# EAGLE design deepak_sch_FInal (EAGLE 7.5.0)
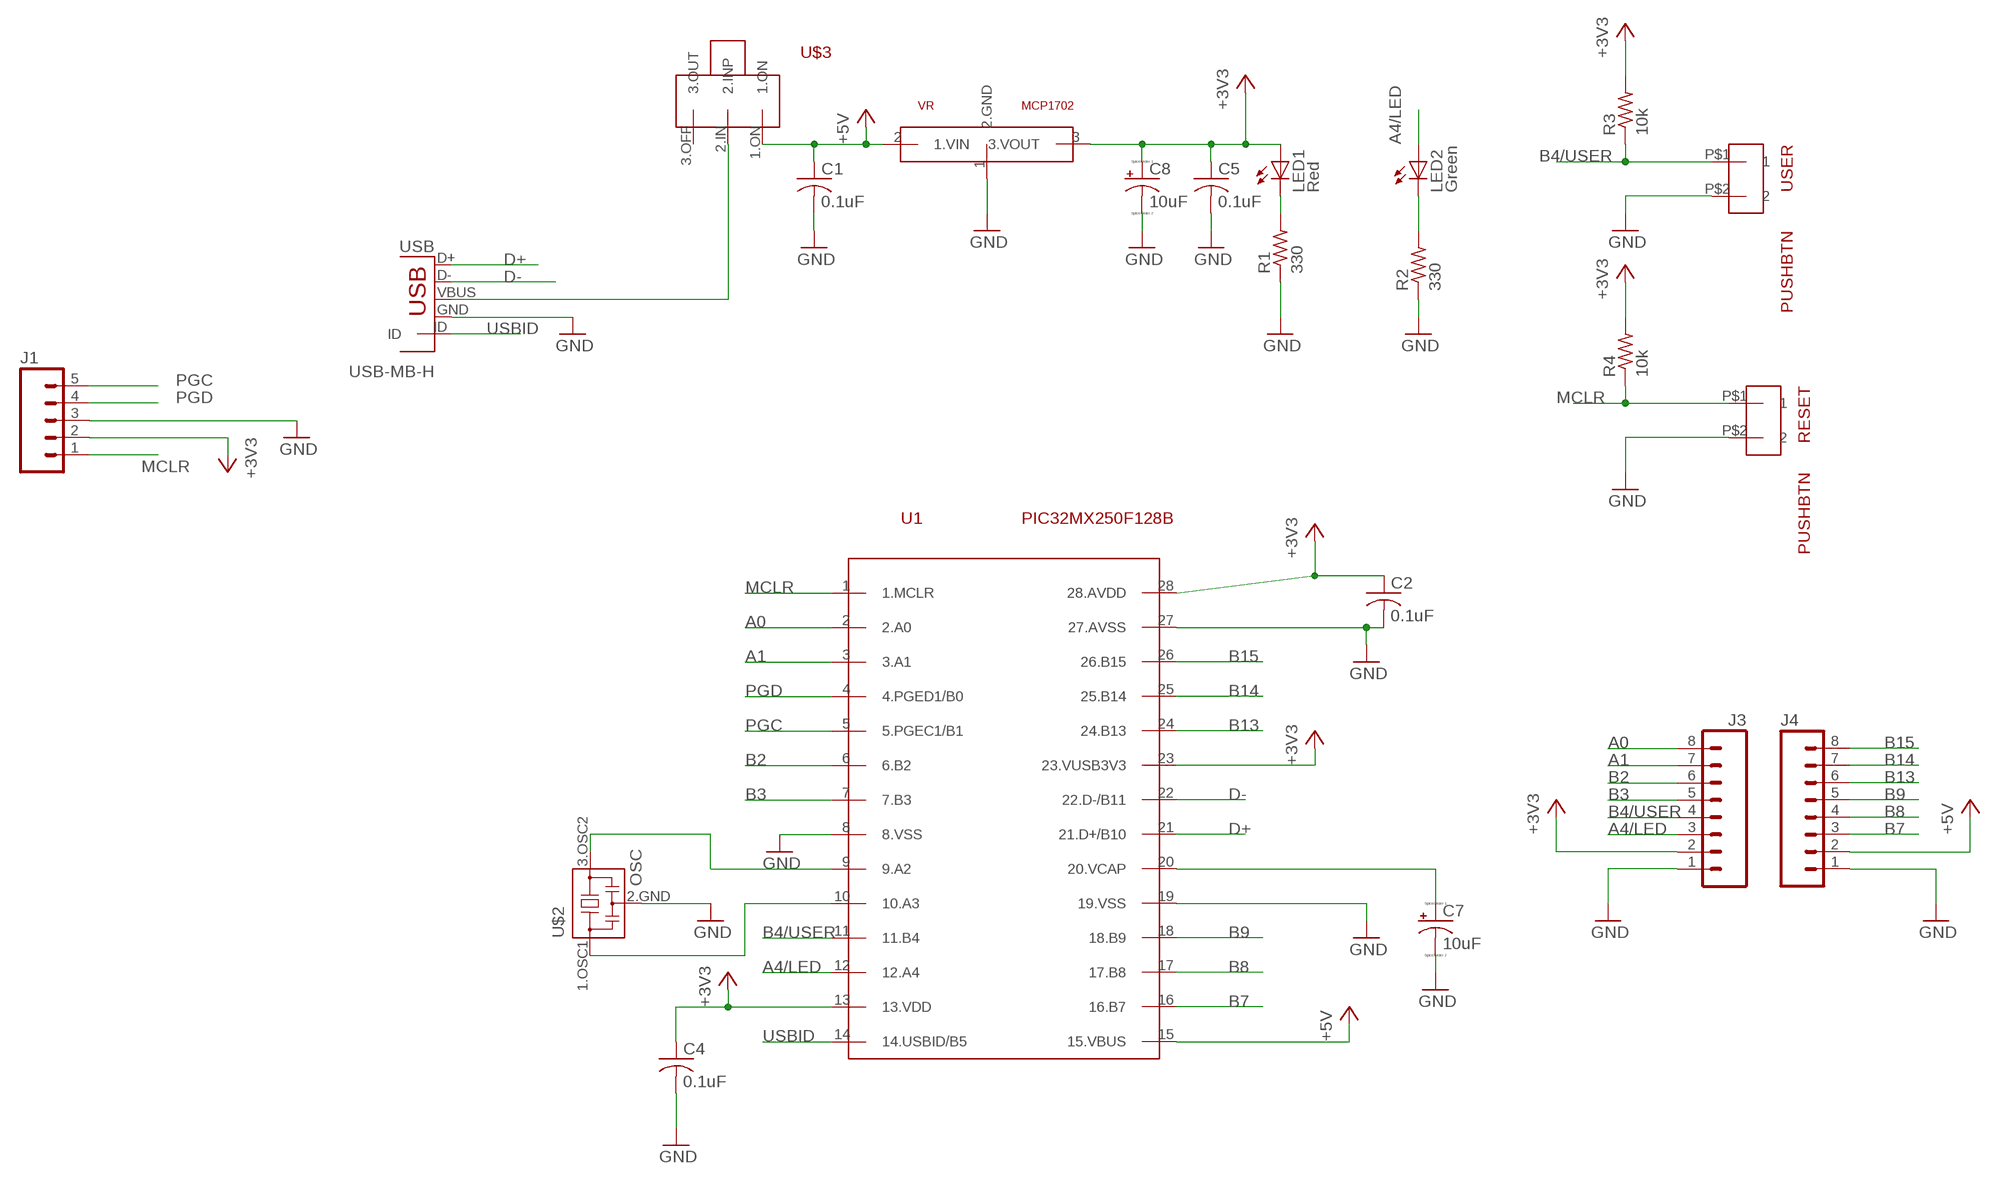
[diagram p0: schematic, sheet 1]

## Parts
C1  0.1uF  C-US025-024X044  [C025-024X044]
C2  0.1uF  C-US025-024X044  [C025-024X044]
C4  0.1uF  C-US025-024X044  [C025-024X044]
C5  0.1uF  C-US025-024X044  [C025-024X044]
C7  10uF  CPOL-USB45181A  [B45181A]
C8  10uF  CPOL-USB45181A  [B45181A]
J1  M05PTH  [1X05]
J3  M08  [1X08_ROUND]
J4  M08  [1X08_ROUND]
LED1  Red  LED3MM  [LED3MM]
LED2  Green  LED3MM  [LED3MM]
R1  330  R-US_0207/10  [0207/10]
R2  330  R-US_0207/10  [0207/10]
R3  10k  R-US_0207/10  [0207/10]
R4  10k  R-US_0207/10  [0207/10]
RESET  PUSHBTN  [PUSHBTN]
U1  PIC32MX250F128B  [DIL28-3]
U$2  OSC  [OSC]
U$3  SLIDESWITCH  [SLIDESWITCH]
USB  USB-MB-H  [USB-MB-H]
USER  PUSHBTN  [PUSHBTN]
VR  MCP1702  [TO92]

## Nets
+3V3: C2.1 C4.1 C5.1 C8.+ J1.2 J3.2 LED1.A R3.2 R4.2 U1.13(13.VDD) U1.23(23.VUSB3V3) U1.28(28.AVDD) VR.3(3.VOUT)
+5V: C1.1 J4.2 U1.15(15.VBUS) U$3.1.ON VR.2(1.VIN)
A0: J3.8 U1.2(2.A0)
A1: J3.7 U1.3(3.A1)
A4/LED: J3.3 LED2.A U1.12(12.A4)
B2: J3.6 U1.6(6.B2)
B3: J3.5 U1.7(7.B3)
B4/USER: J3.4 R3.1 U1.11(11.B4) USER.P$1
B7: J4.3 U1.16(16.B7)
B8: J4.4 U1.17(17.B8)
B9: J4.5 U1.18(18.B9)
B13: J4.6 U1.24(24.B13)
B14: J4.7 U1.25(25.B14)
B15: J4.8 U1.26(26.B15)
D+: U1.21(21.D+/B10) USB.D+
D-: U1.22(22.D-/B11) USB.D-
GND: C1.2 C2.2 C4.2 C5.2 C7.- C8.- J1.3 J3.1 J4.1 R1.1 R2.1 RESET.P$2 U1.8(8.VSS) U1.19(19.VSS) U1.27(27.AVSS) U$2.2.GND USB.GND USER.P$2 VR.1(2.GND)
MCLR: J1.1 R4.1 RESET.P$1 U1.1(1.MCLR)
N$1: U1.9(9.A2) U$2.3.OSC2
N$2: U1.10(10.A3) U$2.1.OSC1
N$3: U$3.2.IN(2.INP) USB.VBUS
N$4: LED2.K(C) R2.2
N$5: LED1.K(C) R1.2
N$11: C7.+ U1.20(20.VCAP)
PGC: J1.5 U1.5(5.PGEC1/B1)
PGD: J1.4 U1.4(4.PGED1/B0)
USBID: U1.14(14.USBID/B5) USB.ID
Unconnected: U$3.3.OFF(3.OUT)

## Library data of the parts
C1 C2 C4 C5 = ME433_2:C-US: CAPACITOR, American symbol
C7 C8 = ME433_2:CPOL-US: POLARIZED CAPACITOR, American symbol
J1 = ME433_2:M05: Header 5 Standard 5-pin 0.1" header. Use with straight break away headers (SKU : PRT-00116), right angle break away headers (PRT-00553), swiss pins (PRT-00743), machine pins (PRT-00117), and female headers (PRT-00115). Molex polarized connector foot print use with SKU : PRT-08230 with associated crimp pins and housings.
J3 J4 = ME433_2:M08: Header 8 Standard 8-pin 0.1" header. Use with straight break away headers (SKU : PRT-00116), right angle break away headers (PRT-00553), swiss pins (PRT-00743), machine pins (PRT-00117), and female headers (PRT-00115).; PROD_ID: CONN-08437
LED1 LED2 = ME433_2:LED: LED OSRAM: - CHIPLED LG R971, LG N971, LY N971, LG Q971, LY Q971, LO R971, LY R971 LH N974, LH R974 LS Q976, LO Q976, LY Q976 LO Q996 - Hyper CHIPLED LW Q18S LB Q993, LB Q99A, LB R99A - SideLED LS A670, LO A670, LY A670, LG A670, LP A670 LB A673, LV A673, LT A673, LW A673 LH A674 LY A675 LS A676, LA A676, LO A676, LY A676, LW A676 LS A679, LY A679, LG A679 - Hyper Micro SIDELED® LS Y876, LA Y876, LO Y876, LY Y876 LT Y87S - SmartLED LW L88C, LW L88S LB L89C, LB L89S, LG L890 LS L89K, LO L89K, LY L89K LS L896, LA L896, LO L896, LY L896 - TOPLED LS T670, LO T670, LY T670, LG T670, LP T670 LSG T670, LSP T670, LSY T670, LOP T670, LYG T670 LG T671, LOG T671, LSG T671 LB T673, LV T673, LT T673, LW T673 LH T674 LS T676, LA T676, LO T676, LY T676, LB T676, LH T676, LSB T676, LW T676 LB T67C, LV T67C, LT T67C, LS T67K, LO T67K, LY T67K, LW E67C LS E67B, LA E67B, LO E67B, LY E67B, LB E67C, LV E67C, LT E67C LW T67C LS T679, LY T679, LG T679 LS T770, LO T770, LY T770, LG T770, LP T770 LB T773, LV T773, LT T773, LW T773 LH T774 LS E675, LA E675, LY E675, LS T675 LS T776, LA T776, LO T776, LY T776, LB T776 LHGB T686 LT T68C, LB T68C - Hyper Mini TOPLED® LB M676 - Mini TOPLED Santana® LG M470 LS M47K, LO M47K, LY M47K Source: http://www.osram.convergy.de LUXEON: - LUMILED® LXK2-PW12-R00, LXK2-PW12-S00, LXK2-PW14-U00, LXK2-PW14-V00 LXK2-PM12-R00, LXK2-PM12-S00, LXK2-PM14-U00 LXK2-PE12-Q00, LXK2-PE12-R00, LXK2-PE12-S00, LXK2-PE14-T00, LXK2-PE14-U00 LXK2-PB12-K00, LXK2-PB12-L00, LXK2-PB12-M00, LXK2-PB14-N00, LXK2-PB14-P00, LXK2-PB14-Q00 LXK2-PR12-L00, LXK2-PR12-M00, LXK2-PR14-Q00, LXK2-PR14-R00 LXK2-PD12-Q00, LXK2-PD12-R00, LXK2-PD12-S00 LXK2-PH12-R00, LXK2-PH12-S00 LXK2-PL12-P00, LXK2-PL12-Q00, LXK2-PL12-R00 Source: www.luxeon.com KINGBRIGHT: KA-3528ASYC Source: www.kingbright.com
R1-R4 = ME433_2:R-US_: RESISTOR, American symbol
RESET USER = ME433_2:PUSHBTN
U1 = ME433_2:PIC32MX250F128B
U$2 = ME433_2:OSC
U$3 = ME433_2:SLIDESWITCH
USB = ME433_2:USB: USB Connectors USB-B-PTH is fully proven SKU : PRT-00139/CONN-08278 USB-miniB is fully proven SKU : PRT-00587 USB-A-PCB is untested. USB-A-H is throughly reviewed, but untested. Spark Fun Electronics SKU : PRT-00437 USB-B-SMT is throughly reviewed, but untested. Needs silkscreen touching up. USB-A-S has not been used/tested USB-MB-H has not been used/tested USB-MICROB has been used. CONN-09505
VR = ME433_2:MCP1702

## Board
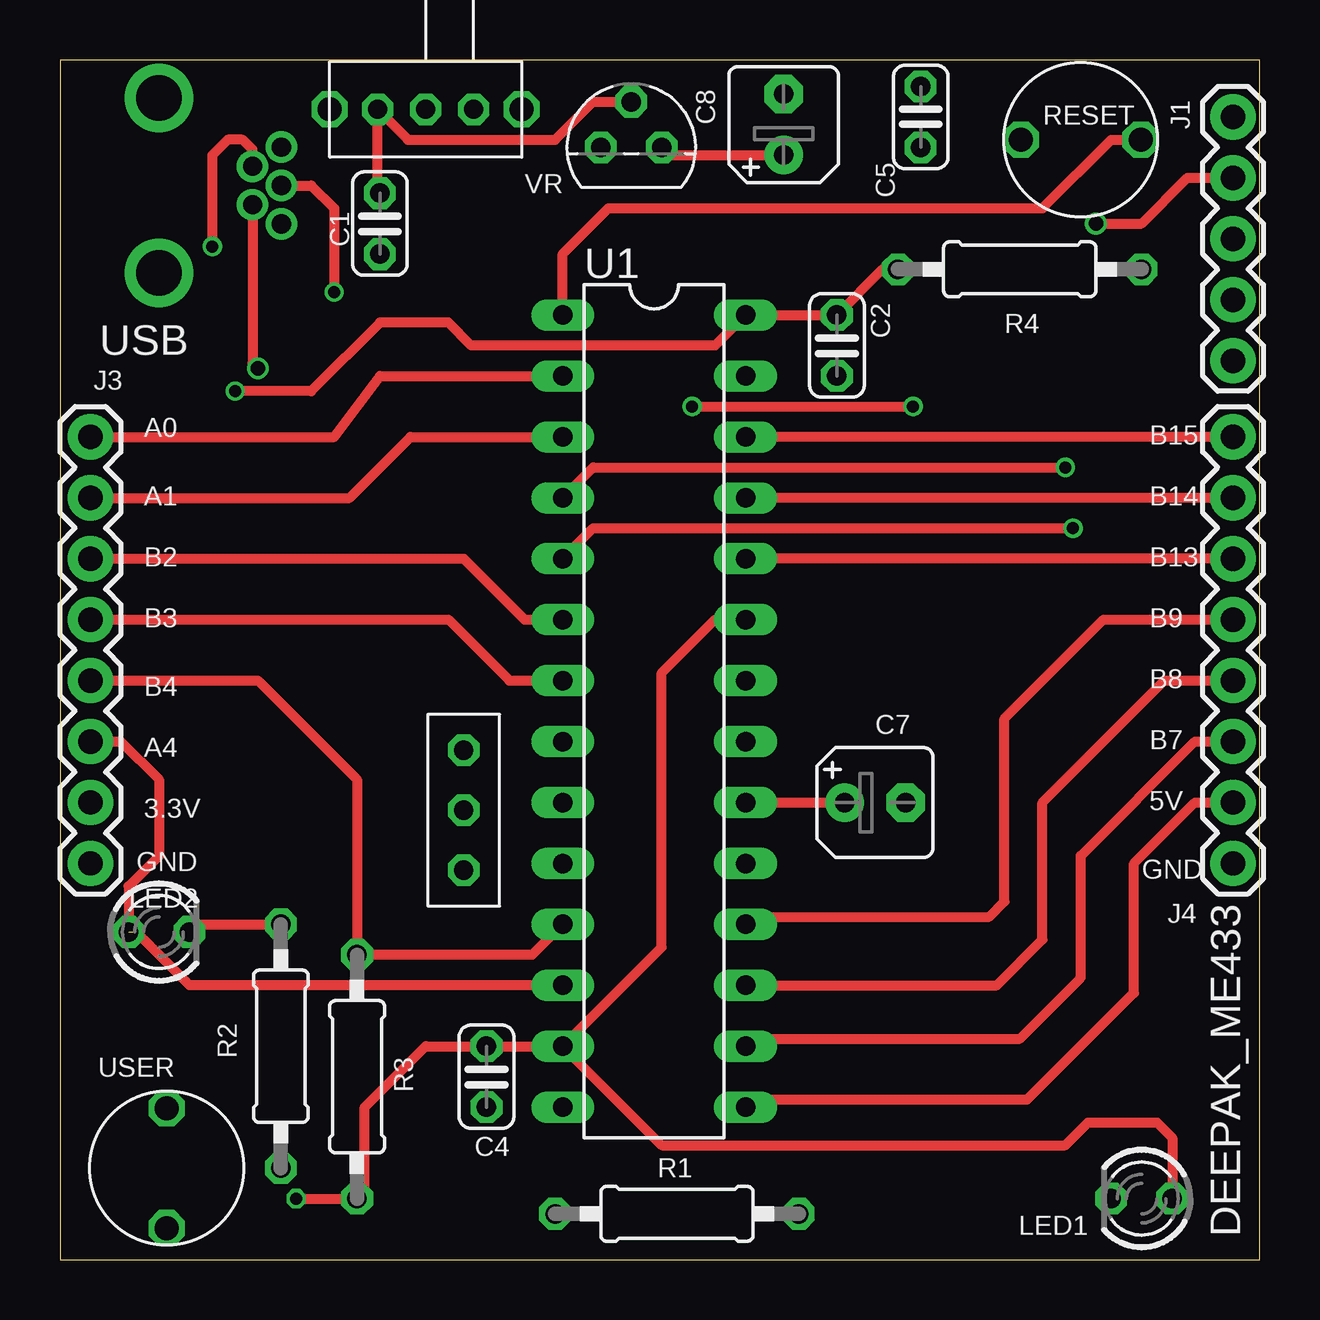
[diagram p1: board, top side]
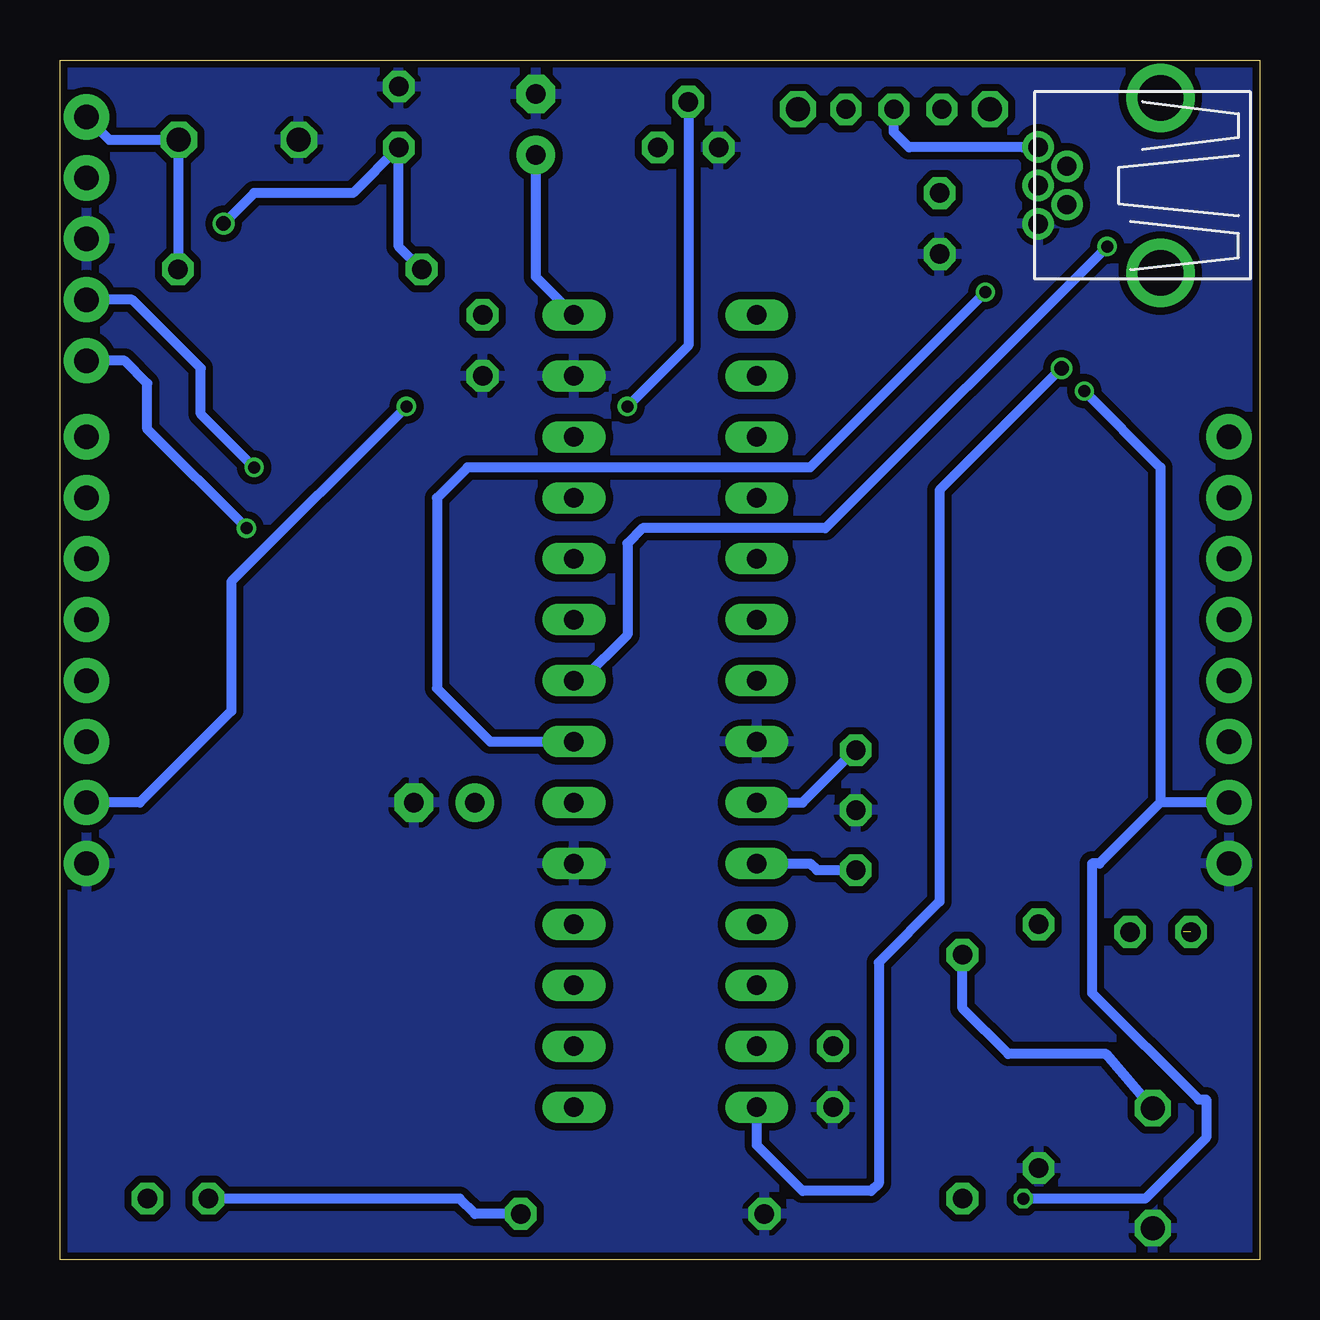
[diagram p2: board, bottom side, seen from below]

Size 50 x 50 mm. Coordinates in mm from the lower left corner, seen from the top.
Outline: 0,0 50,0 50,50 0,50 0,0
Copper layers (1*16): Top 0.035mm / dielectric 1.5mm / Bottom 0.035mm
Design rules "SeeedStudio_2layer_DRU_no_angle_20140221": minimum track width 6mil, minimum drill 12mil, track to track 6mil, track to pad 6mil, pad to pad 6mil, via to via 6mil, smd to smd 0mil, copper to edge 10mil, drill to drill 10mil, minimum pad ring 10mil, minimum via ring 6mil, stop-mask expansion 2mil, vias tented up to drill 100mil, thermal gap 10mil

### Footprints (pad centres in the part's own frame; a part is rotated, then mirrored left to right if it is on the bottom)
C025-024X044 = drill 0.813 octagon: 1 -1.27,0; 2 1.27,0
B45181A = drill 0.813 pad 1.6: + -1.27,0 | drill 0.813 pad 1.6 octagon: - 1.27,0
1X05 = drill 1.016 pad 1.88: 1 0,0; 2 2.54,0; 3 5.08,0; 4 7.62,0; 5 10.16,0
1X08_ROUND = drill 1.016 pad 1.88: 1 0,0; 2 2.54,0; 3 5.08,0; 4 7.62,0; 5 10.16,0; 6 12.7,0; 7 15.24,0; 8 17.78,0
LED3MM = drill 0.813 octagon: A -1.27,0; K 1.27,0
0207/10 = drill 0.813 octagon: 1 -5.08,0; 2 5.08,0
PUSHBTN = drill 1 octagon: P$1 -2.5,0; P$2 2.5,0
DIL28-3 = drill 0.813 long: 1 -16.51,-3.81; 2 -13.97,-3.81; 3 -11.43,-3.81; 4 -8.89,-3.81; 5 -6.35,-3.81; 6 -3.81,-3.81; 7 -1.27,-3.81; 8 1.27,-3.81; 9 3.81,-3.81; 10 6.35,-3.81; 11 8.89,-3.81; 12 11.43,-3.81; 13 13.97,-3.81; 14 16.51,-3.81; 15 16.51,3.81; 16 13.97,3.81; 17 11.43,3.81; 18 8.89,3.81; 19 6.35,3.81; 20 3.81,3.81; 21 1.27,3.81; 22 -1.27,3.81; 23 -3.81,3.81; 24 -6.35,3.81; 25 -8.89,3.81; 26 -11.43,3.81; 27 -13.97,3.81; 28 -16.51,3.81
OSC = drill 0.8 octagon: 1.OSC1 -2.5,0; 2.GND 0,0; 3.OSC2 2.5,0
SLIDESWITCH = drill 0.8 octagon: 1.ON -2,0; 2.IN 0,0; 3.OFF 2,0 | drill 1 octagon: P$4 -4,0; P$5 4,0
USB-MB-H = drill 0.8: D+ 5.1,0; D- 3.9,0.8; GND 5.1,-1.6; ID 3.9,-0.8; VBUS 5.1,1.6 | drill 1.9: P$6 0,-3.65; P$7 0,3.65
TO92 = drill 0.813 octagon: 1 -1.27,0; 2 0,1.905; 3 1.27,0

### Placement (x,y rotation side)
C1  13.34,43.18 270 top
C2  32.38,38.1 270 top
C4  17.78,7.62 270 top
C5  35.88,47.62 90 top
C7  33.97,19.05 0 top
C8  30.16,47.31 90 top
J1  48.9,47.62 270 top
J3  1.27,16.51 90 top
J4  48.9,16.51 90 top
LED1  45.09,2.54 180 top
LED2  4.13,13.65 0 top
R1  25.72,1.91 0 top
R2  9.21,8.89 90 top
R3  12.38,7.62 270 top
R4  40.01,41.27 180 top
RESET  42.55,46.67 180 top
U1  24.77,22.86 270 top
U$2  16.83,18.73 90 top
U$3  15.24,47.94 0 top
USB  4.13,44.77 0 top
USER  4.45,3.81 270 top
VR  23.81,46.35 0 top

### Tracks (layer width: path | path; a pad name or v marks a point on that pad's centre or on a via)
+3V3  (via drill 0.5, 0.6)
  Top 0.406: U1.13 C4.1 15.24,8.89 12.7,6.35 12.7,2.86 R3.2 v9.84,2.54 | R4.2 34.29,41.27 C2.1 U1.28 27.3,38.1 17.14,38.1 16.19,39.05 13.34,39.05 10.48,36.2 v7.3,36.2 | U1.13 25.08,4.76 41.91,4.76 42.86,5.71 45.72,5.71 46.35,5.08 LED1.A | U1.13 25.08,13.02 25.08,24.45 27.3,26.67 U1.23 | VR.3 25.4,46.04 C8.+ | v43.18,43.18 45.09,43.18 46.99,45.09 J1.2
  Bottom 0.406: J3.2 4.13,19.05 | 4.13,19.05 6.67,16.51 6.99,16.51 6.99,11.11 2.54,6.67 2.22,6.67 2.22,5.08 4.76,2.54 v9.84,2.54 | U1.28 30.16,40.96 C8.+ | R4.2 35.88,42.23 C5.1 37.78,44.45 41.91,44.45 v43.18,43.18 | v7.3,36.2 4.13,33.02 4.13,19.05
+5V  (via drill 0.5)
  Top 0.406: U1.15 28.89,6.67 40.32,6.67 44.77,11.11 44.77,16.51 47.31,19.05 J4.2 | C1.1 13.24,44.55 U$3.1.ON 14.51,46.67 20.64,46.67 22.23,48.26 VR.2 | v26.35,35.56 v35.56,35.56
  Bottom 0.406: VR.2 23.81,38.1 v26.35,35.56 | v35.56,35.56 42.86,28.26 42.86,22.86 46.67,19.05 J4.2
A0
  Top 0.406: J3.8 11.43,34.29 13.34,36.83 U1.2
A1
  Top 0.406: J3.7 12.06,31.75 14.61,34.29 U1.3
A4/LED  (1 unrouted)
  Top 0.406: U1.12 5.4,11.43 3.17,13.65 | J3.3 2.54,21.59 4.13,20 4.13,16.83 2.86,15.56 LED2.A
B2
  Top 0.406: J3.6 16.83,29.21 19.37,26.67 U1.6
B3
  Top 0.406: J3.5 16.19,26.67 18.73,24.13 U1.7
B4/USER
  Top 0.406: J3.4 8.26,24.13 12.38,20 R3.1 19.68,12.7 U1.11
  Bottom 0.406: USER.P$1 6.39,8.57 10.48,8.57 12.38,10.48 R3.1
B7
  Top 0.406: U1.16 28.89,9.21 40.01,9.21 42.55,11.75 42.55,16.83 47.31,21.59 J4.3
B8
  Top 0.406: U1.17 39.05,11.43 40.96,13.34 40.96,19.05 46.04,24.13 J4.4
B9
  Top 0.406: U1.18 28.89,14.29 38.73,14.29 39.37,14.92 39.37,22.54 43.5,26.67 J4.5
B13
  Top 0.406: J4.6 U1.24
B14
  Top 0.406: J4.7 U1.25
B15
  Top 0.406: J4.8 U1.26
D+  (via drill 0.5)
  Top 0.406: v11.43,40.32 11.43,43.81 10.48,44.77 USB.D+
  Bottom 0.406: v11.43,40.32 18.73,33.02 33.02,33.02 34.29,31.75 34.29,23.81 32.07,21.59 U1.21
D-  (via drill 0.5)
  Top 0.406: v6.35,42.23 6.35,46.04 6.99,46.67 7.62,46.67 8.03,46.27 USB.D-
  Bottom 0.406: v6.35,42.23 18.1,30.48 25.72,30.48 26.35,29.84 26.35,26.04 28.26,24.13 U1.22
GND
  pour Bottom (isolate 0.305): 0,49.85 0,-0.32 50.16,-0.32 50.16,0.32 50.16,49.85
MCLR
  Top 0.406: U1.1 20.95,41.91 22.86,43.81 40.96,43.81 43.81,46.67 RESET.P$1
  Bottom 0.406: RESET.P$1 45.09,46.63 | J1.1 47.94,46.67 RESET.P$1 | R4.1 45.05,41.27 RESET.P$1
N$1
  Bottom 0.406: U1.9 19.05,19.05 16.87,21.23 U$2.3.OSC2
N$2
  Bottom 0.406: U1.10 18.73,16.51 18.45,16.23 U$2.1.OSC1
N$3
  Bottom 0.406: USB.VBUS 9.88,46.35 14.61,46.35 15.24,46.99 U$3.2.IN
N$4
  Top 0.406: LED2.K 5.71,13.97 R2.2
N$5
  Bottom 0.406: R1.2 32.7,1.91 33.34,2.54 LED1.K
N$11
  Top 0.406: U1.20 C7.+
PGC  (via drill 0.5)
  Top 0.406: U1.5 22.23,30.48 v42.23,30.48
  Bottom 0.406: v42.23,30.48 46.35,34.61 46.35,36.51 47.31,37.47 J1.5
PGD  (via drill 0.5)
  Top 0.406: U1.4 22.23,33.02 v41.91,33.02
  Bottom 0.406: v41.91,33.02 44.13,35.24 44.13,37.15 46.99,40.01 J1.4
USBID  (via drill 0.6)
  Top 0.406: USB.ID 8.03,37.38 v8.26,37.15
  Bottom 0.406: v8.26,37.15 13.34,32.07 13.34,14.92 15.88,12.38 15.88,3.17 16.19,2.86 19.05,2.86 20.95,4.76 U1.14

### Text on the board
tPlace: RESET | A0 | B15 | A1 | B14 | B2 | B13 | B3 | B9 | B8 | B4 | A4 | B7 | 5V | 3.3V | GND | GND | USER | DEEPAK_ME433